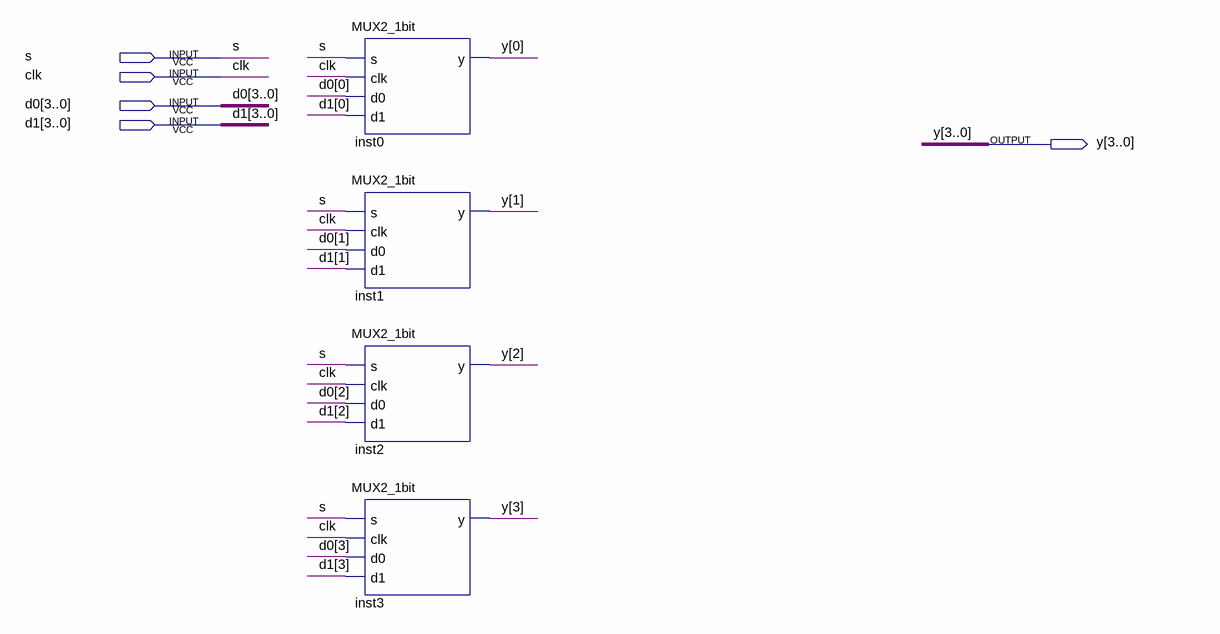
[diagram p0: schematic sheet]
// Quartus schematic 2MUX_8bit.bdf as structural Verilog: 4 symbols, 5 pins
module \2MUX_8bit  (
  input  s,
  input  clk,
  input  [3:0] d0,
  input  [3:0] d1,
  output [3:0] y
);

  MUX2_1bit inst0 (.s(s), .clk(clk), .d0(d0[0]), .d1(d1[0]), .y(y[0]));
  MUX2_1bit inst1 (.s(s), .clk(clk), .d0(d0[1]), .d1(d1[1]), .y(y[1]));
  MUX2_1bit inst2 (.s(s), .clk(clk), .d0(d0[2]), .d1(d1[2]), .y(y[2]));
  MUX2_1bit inst3 (.s(s), .clk(clk), .d0(d0[3]), .d1(d1[3]), .y(y[3]));
endmodule
